# Altium schematic sheet LEDCube.SchDoc
size Letter
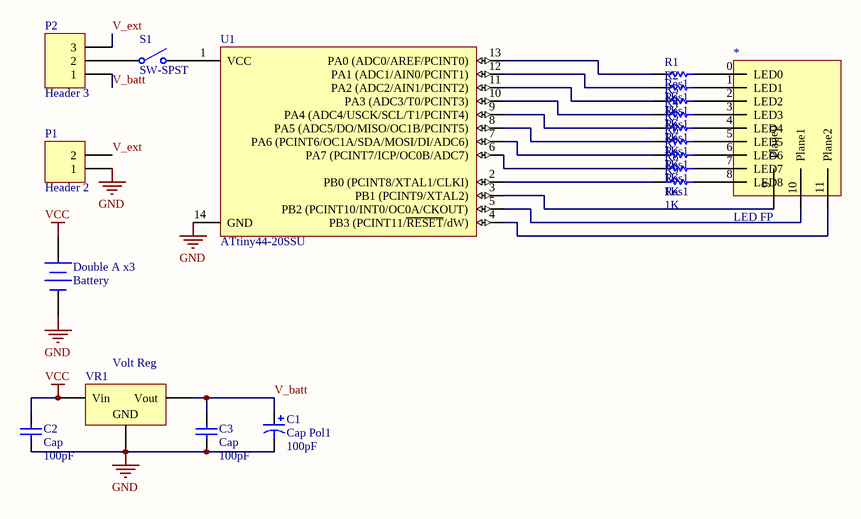
[diagram p0: LEDCube.SchDoc]

## Parts
*  LED FP  [Cube Column FP]
C1  Cap Pol1  value 100pF  [RB7.6-15]
C2  Cap  value 100pF  [RAD-0.3]
C3  Cap  value 100pF  [RAD-0.3]
Double_A_x3  Battery  [BAT-2]
P1  Header 2  [HDR1X2]
P2  Header 3  [HDR1X3]
R1  Res1  value 1K  [AXIAL-0.3]
R2  Res1  value 1K  [AXIAL-0.3]
R3  Res1  value 1K  [AXIAL-0.3]
R4  Res1  value 1K  [AXIAL-0.3]
R5  Res1  value 1K  [AXIAL-0.3]
R6  Res1  value 1K  [AXIAL-0.3]
R7  Res1  value 1K  [AXIAL-0.3]
R8  Res1  value 1K  [AXIAL-0.3]
R9  Res1  value 1K  [AXIAL-0.3]
S1  SW-SPST  [SPST-2]
U1  ATtiny44-20SSU  [14S1_N]
VR1  Volt Reg  [D2PAK_N]

## Nets
GND: C1.2 C2.1 C3.1 Double_A_x3.2(-) P1.1 U1.14(GND) VR1.2(GND)
VCC: C2.2 Double_A_x3.1(+) VR1.1(Vin)
V_batt: C1.1 C3.2 P2.1 VR1.3(Vout)
V_ext: P1.2 P2.3
Net*_0: *.0(LED0) R1.2
Net*_1: *.1(LED1) R2.2
Net*_2: *.2(LED2) R3.2
Net*_3: *.3(LED3) R4.2
Net*_4: *.4(LED4) R5.2
Net*_5: *.5(LED5) R6.2
Net*_6: *.6(LED6) R7.2
Net*_7: *.7(LED7) R8.2
Net*_8: *.8(LED8) R9.2
Net*_9: *.9(Plane0) U1.3(PB1_(PCINT9/XTAL2))
Net*_10: *.10(Plane1) U1.5(PB2_(PCINT10/INT0/OC0A/CKOUT))
Net*_11: *.11(Plane2) U1.4(PB3_(PCINT11/~{RESET}/dW))
NetP2_2: P2.2 S1.1(COMMON)
NetR1_1: R1.1 U1.13(PA0_(ADC0/AREF/PCINT0))
NetR2_1: R2.1 U1.12(PA1_(ADC1/AIN0/PCINT1))
NetR3_1: R3.1 U1.11(PA2_(ADC2/AIN1/PCINT2))
NetR4_1: R4.1 U1.10(PA3_(ADC3/T0/PCINT3))
NetR5_1: R5.1 U1.9(PA4_(ADC4/USCK/SCL/T1/PCINT4))
NetR6_1: R6.1 U1.8(PA5_(ADC5/DO/MISO/OC1B/PCINT5))
NetR7_1: R7.1 U1.7(PA6_(PCINT6/OC1A/SDA/MOSI/DI/ADC6))
NetR8_1: R8.1 U1.6(PA7_(PCINT7/ICP/OC0B/ADC7))
NetR9_1: R9.1 U1.2(PB0_(PCINT8/XTAL1/CLKI))
NetS1_2: S1.2(NO) U1.1(VCC)

## Library data of the parts
C1 = Cap Pol1: Polarized Capacitor (Radial); Published: 8-Jun-2000; LatestRevisionDate: 17-Jul-2002; LatestRevisionNote: Re-released for DXP Platform.; PackageReference: RB7.6-15; Publisher: Altium Limited; PackageDescription: Polarized Capacitor (Radial); 2 Leads
C2 C3 = Cap: Capacitor; Published: 8-Jun-2000; LatestRevisionDate: 17-Jul-2002; LatestRevisionNote: Re-released for DXP Platform.; PackageReference: RAD-0.3; Publisher: Altium Limited; PackageDescription: Radial Cap, Thru-Hole; 2 Leads; 0.3 in Pin Spacing
Double_A_x3 = Battery: Multicell Battery; Published: 24-Mar-1999; LatestRevisionDate: 17-Jul-2002; LatestRevisionNote: Re-released for DXP Platform.; PackageReference: BAT-2; Publisher: Altium Limited; PackageDescription: Battery; 2 Leads
P1 = Header 2: Header, 2-Pin; LatestRevisionDate: 17-Jul-2002; LatestRevisionNote: Re-released for DXP Platform.; Publisher: Altium Limited
P2 = Header 3: Header, 3-Pin; LatestRevisionDate: 17-Jul-2002; LatestRevisionNote: Re-released for DXP Platform.; Publisher: Altium Limited
R1-R9 = Res1: Resistor; Published: 8-Jun-2000; LatestRevisionDate: 17-Jul-2002; LatestRevisionNote: Re-released for DXP Platform.; PackageReference: AXIAL-0.3; Publisher: Altium Limited; PackageDescription: Axial Device, Thru-Hole; 2 Leads; 0.3 in Pin Spacing
S1 = SW-SPST: Single-Pole, Single-Throw Switch; Published: 24-Mar-1999; LatestRevisionDate: 17-Jul-2002; LatestRevisionNote: Re-released for DXP Platform.; PackageReference: SPST-2; Publisher: Altium Limited; PackageDescription: Switch; 2 Leads
U1 = ATtiny44-20SSU: 8-bit AVR Microcontroller, 2.7-5.5V, 4KB Flash, 256 Bytes EEPROM, 256 Bytes SRAM, 14-pin SOIC, Industrial Grade (-40°C to 85°C), Pb-Free; ComponentAvailability: Not recommended for new design.; Published: 1-Apr-2010; DatasheetVersion: revH, Oct-2009; PackageVersion: revA, Feb-2002; PackageReference: 14S1; Publisher: Altium Limited; PackageDescription: 14-Lead, 0.150” Wide Body, Plastic Gull Wing Small Outline Package (SOIC); Supplier 1: Digi-Key; Supplier Part Number 1: ATTINY44-20SSU-ND; Supplier 2: Farnell; Supplier Part Number 2: 1455152; Supplier 3: Mouser; Supplier Part Number 3: 556-ATTINY44-20SSU; Code_JEDEC: MS-012-AB; Code_IPC: SOIC127P600-14; ComponentLink1Description: Manufacturer Link; ComponentLink1URL: http://www.atmel.com/products/avr/default.asp?; ComponentLink2Description: ATtiny24/44/84 Datasheet; ComponentLink2URL: http://www.atmel.com/dyn/resources/prod_documents/doc8006.pdf; ComponentLink3Description: ATtiny24/44/84 Summary; ComponentLink3URL: http://www.atmel.com/dyn/resources/prod_documents/8006S.pdf; ComponentLink4Description: Atmel.com Home; ComponentLink4URL: http://www.atmel.com
VR1 = Volt Reg: Voltage Regulator; Published: 24-Mar-1999; LatestRevisionDate: 29-May-2009; LatestRevisionNote: IPC-7351 Footprint Added.; PackageReference: D2PAK; Publisher: Altium Limited; PackageDescription: 3-Pin Transistor Outline Package 2.54 mm Pitch, 15.1 mm Lead Span